# EAGLE design LimitSwitchandMotorBoard (EAGLE 9.6.2)
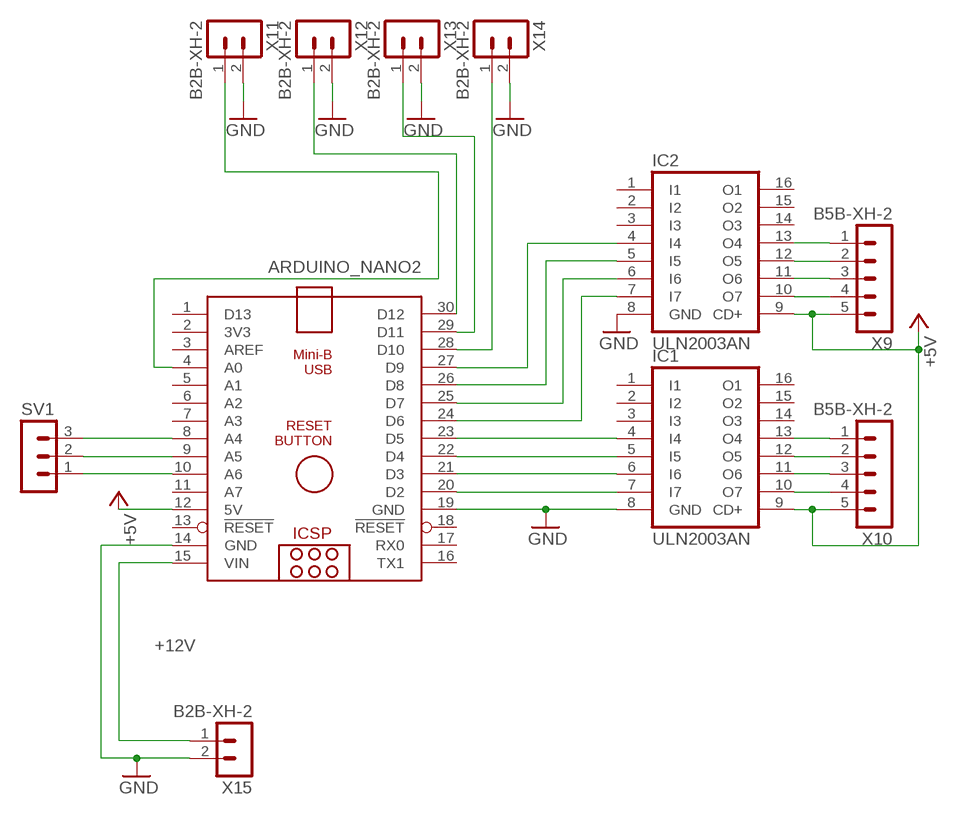
[diagram p0: schematic, sheet 1]

## Parts
ARDUINO_NANO2  ARDUINO_NANO  [ARDUINO_NANO]
IC1  ULN2003AN  [DIL16]
IC2  ULN2003AN  [DIL16]
SV1  MA03-1  [MA03-1]
X9  B5B-XH-2  [B5B-XH-A]
X10  B5B-XH-2  [B5B-XH-A]
X11  B2B-XH-2  [B2B-XH-A]
X12  B2B-XH-2  [B2B-XH-A]
X13  B2B-XH-2  [B2B-XH-A]
X14  B2B-XH-2  [B2B-XH-A]
X15  B2B-XH-2  [B2B-XH-A]

## Nets
+5V: ARDUINO_NANO2.12(5V) IC1.9(CD+) IC2.9(CD+) X9.5 X10.5
+12V: ARDUINO_NANO2.15(VIN) X15.1
GND: ARDUINO_NANO2.14(GND) ARDUINO_NANO2.19(GND) IC1.8(GND) IC2.8(GND) X11.2 X12.2 X13.2 X14.2 X15.2
N$1: ARDUINO_NANO2.29(D11) X13.1
N$2: IC1.10(O7) X10.4
N$3: IC1.11(O6) X10.3
N$4: IC1.12(O5) X10.2
N$5: IC1.13(O4) X10.1
N$6: IC2.10(O7) X9.4
N$7: IC2.11(O6) X9.3
N$8: IC2.12(O5) X9.2
N$9: IC2.13(O4) X9.1
N$10: ARDUINO_NANO2.20(D2) IC1.7(I7)
N$11: ARDUINO_NANO2.21(D3) IC1.6(I6)
N$12: ARDUINO_NANO2.22(D4) IC1.5(I5)
N$13: ARDUINO_NANO2.23(D5) IC1.4(I4)
N$14: ARDUINO_NANO2.27(D9) IC2.4(I4)
N$15: ARDUINO_NANO2.26(D8) IC2.5(I5)
N$16: ARDUINO_NANO2.25(D7) IC2.6(I6)
N$17: ARDUINO_NANO2.24(D6) IC2.7(I7)
N$18: ARDUINO_NANO2.30(D12) X12.1
N$19: ARDUINO_NANO2.4(A0) X11.1
N$20: ARDUINO_NANO2.8(A4) SV1.3
N$21: ARDUINO_NANO2.9(A5) SV1.2
N$22: ARDUINO_NANO2.10(A6) SV1.1
N$26: ARDUINO_NANO2.28(D10) X14.1
Unconnected: ARDUINO_NANO2.1(D13) ARDUINO_NANO2.2(3V3) ARDUINO_NANO2.3(AREF) ARDUINO_NANO2.5(A1) ARDUINO_NANO2.6(A2) ARDUINO_NANO2.7(A3) ARDUINO_NANO2.11(A7) ARDUINO_NANO2.13(!RESET) ARDUINO_NANO2.16(TX1) ARDUINO_NANO2.17(RX0) ARDUINO_NANO2.18(!RESET) IC1.1(I1) IC1.2(I2) IC1.3(I3) IC1.14(O3) IC1.15(O2) IC1.16(O1) IC2.1(I1) IC2.2(I2) IC2.3(I3) IC2.14(O3) IC2.15(O2) IC2.16(O1)

## Library data of the parts
ARDUINO_NANO2 = ArduinoNanoV31:ARDUINO_NANO: Arduino Nano V3.0 Overview: The Arduino Nano is a small, complete, and breadboard-friendly board based on the ATmega328 (Arduino Nano 3.x) or ATmega168 (Arduino Nano 2.x). It has more or less the same functionality of the Arduino Duemilanove, but in a different package. It lacks only a DC power jack, and works with a Mini-B USB cable instead of a standard one. The Nano was designed and is being produced by Gravitech. Specifications: Microcontroller Atmel ATmega168 or ATmega328 Operating Voltage (logic level) 5 V Input Voltage (recommended) 7-12 V Input Voltage (limits) 6-20 V Digital I/O Pins 14 (of which 6 provide PWM output) Analog Input Pins 8 DC Current per I/O Pin 40 mA Flash Memory 16 KB (ATmega168) or 32 KB (ATmega328) of which 2 KB used by bootloader SRAM 1 KB (ATmega168) or 2 KB (ATmega328) EEPROM 512 bytes (ATmega168) or 1 KB (ATmega328) Clock Speed 16 MHz Dimensions 0.73" x 1.70" Length 45 mm Width 18 mm Weigth 5 g Power: The Arduino Nano can be powered via the Mini-B USB connection, 6-20V unregulated external power supply (pin 30), or 5V regulated external power supply (pin 27). The power source is automatically selected to the highest voltage source. Memory: The ATmega168 has 16 KB of flash memory for storing code (of which 2 KB is used for the bootloader); the ATmega328 has 32 KB, (also with 2 KB used for the bootloader). The ATmega168 has 1 KB of SRAM and 512 bytes of EEPROM (which can be read and written with the EEPROM library); the ATmega328 has 2 KB of SRAM and 1 KB of EEPROM. Input and Output: Each of the 14 digital pins on the Nano can be used as an input or output, using pinMode(), digitalWrite(), and digitalRead() functions. They operate at 5 volts. Each pin can provide or receive a maximum of 40 mA and has an internal pull-up resistor (disconnected by default) of 20-50 kOhms. In addition, some pins have specialized functions. Visit Arduino - ArduinoBoardNano <https://www.arduino.cc/en/Main/ArduinoBoardNano>
IC1 IC2 = uln-udn:ULN2003A: DRIVER ARRAY
SV1 = con-lstb:MA03-1: PIN HEADER; OC_FARNELL: unknown; OC_NEWARK: unknown
X9 X10 = con-JST XH:B5B-XH: JST XH series header 2.50mm pitch disconnectable crimp style connectors, vertical (side entry type), 5 pins
X11-X15 = con-JST XH:B2B-XH: JST XH series header 2.50mm pitch disconnectable crimp style connectors, vertical (side entry type), 2 pins

## Board
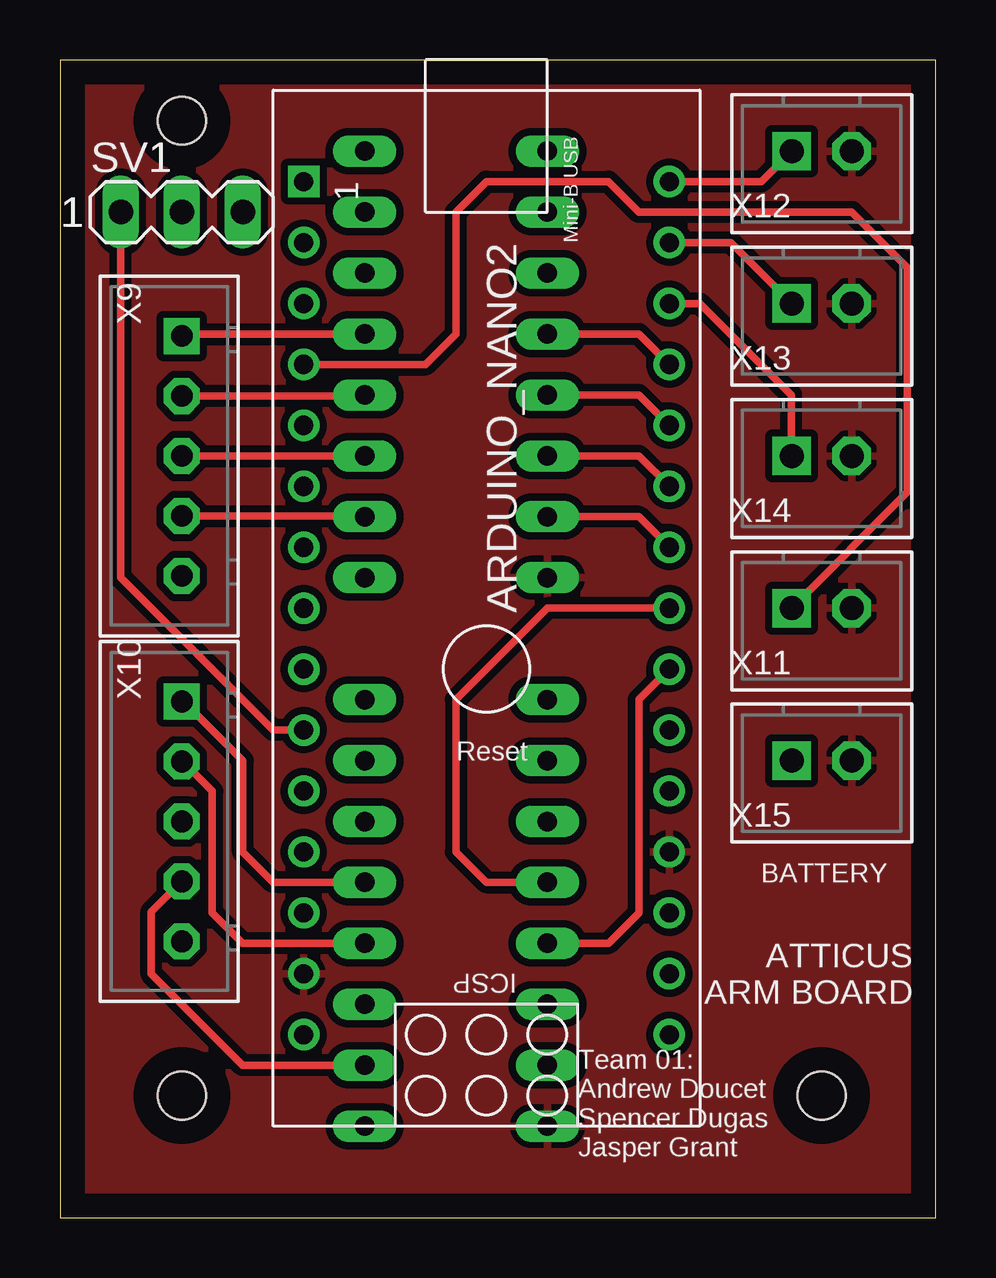
[diagram p1: board, top side]
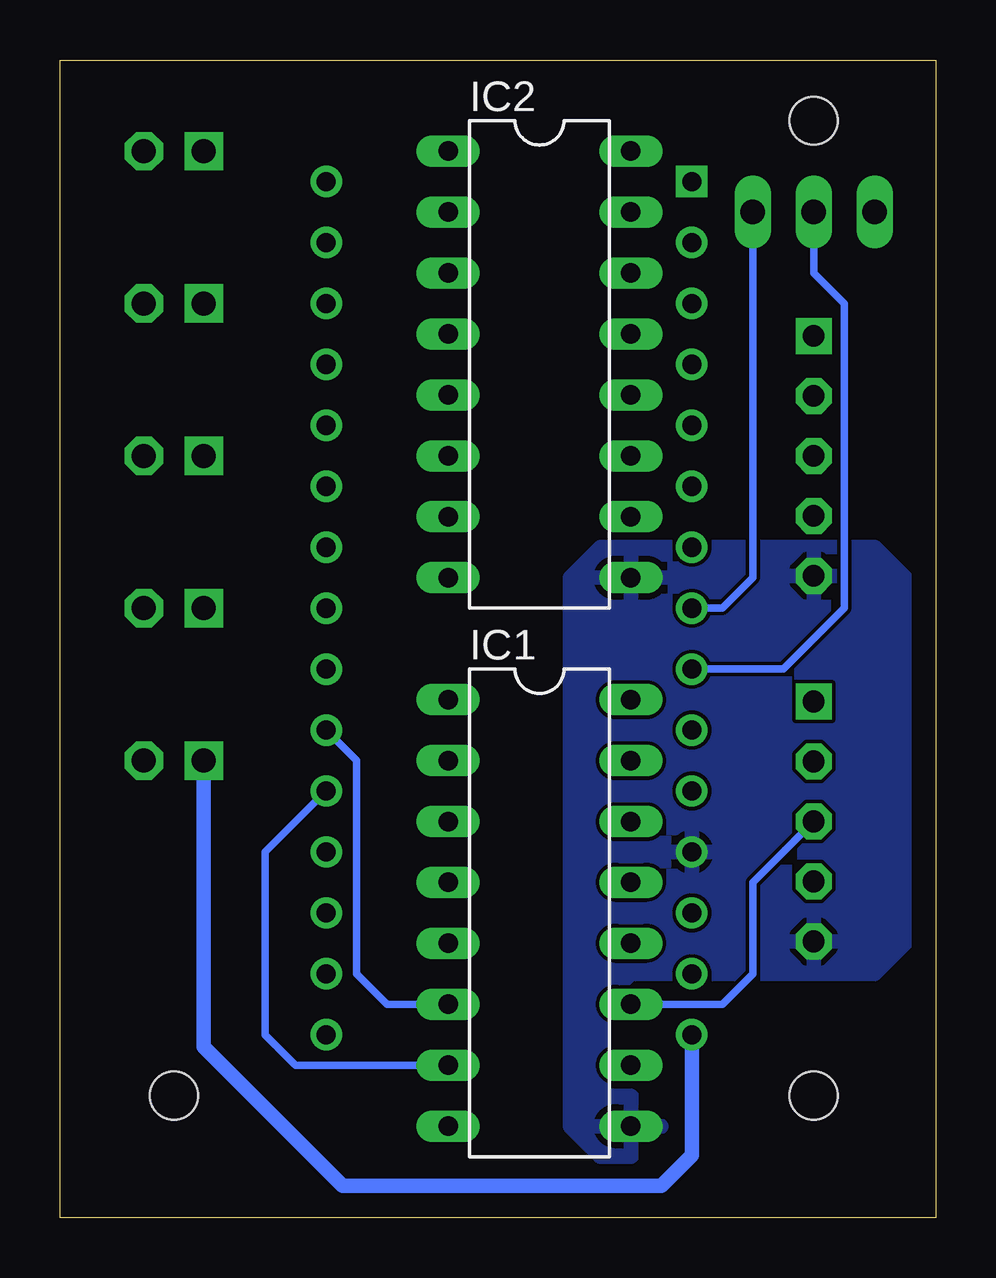
[diagram p2: board, bottom side, seen from below]

Size 36.5 x 48.25 mm. Coordinates in mm from the lower left corner, seen from the top.
Outline: 0,0 36.5,0 36.5,48.25 0,48.25 0,0
Copper layers (1*16): Top 0.035mm / dielectric 1.5mm / Bottom 0.035mm
Design rules "default": minimum track width 6mil, minimum drill 0.35mm, track to track 6mil, track to pad 6mil, pad to pad 6mil, via to via 6mil, smd to smd 6mil, copper to edge 40mil, drill to drill 6mil, minimum pad ring 10mil, minimum via ring 8mil, stop-mask expansion 4mil, vias tented up to drill 0mil, thermal gap 10mil
Holes 2 mm at 5.08,45.72 31.75,5.08 5.08,5.08

### Footprints (pad centres in the part's own frame; a part is rotated, then mirrored left to right if it is on the bottom)
ARDUINO_NANO = drill 0.8 square: 1 -20.32,-7.62 | drill 0.8: 2 -17.78,-7.62; 3 -15.24,-7.62; 4 -12.7,-7.62; 5 -10.16,-7.62; 6 -7.62,-7.62; 7 -5.08,-7.62; 8 -2.54,-7.62; 9 0,-7.62; 10 2.54,-7.62; 11 5.08,-7.62; 12 7.62,-7.62; 13 10.16,-7.62; 14 12.7,-7.62; 15 15.24,-7.62; 16 15.24,7.62; 17 12.7,7.62; 18 10.16,7.62; 19 7.62,7.62; 20 5.08,7.62; 21 2.54,7.62; 22 0,7.62; 23 -2.54,7.62; 24 -5.08,7.62; 25 -7.62,7.62; 26 -10.16,7.62; 27 -12.7,7.62; 28 -15.24,7.62; 29 -17.78,7.62; 30 -20.32,7.62
DIL16 = drill 0.813 long: 1 -8.89,-3.81; 2 -6.35,-3.81; 3 -3.81,-3.81; 4 -1.27,-3.81; 5 1.27,-3.81; 6 3.81,-3.81; 7 6.35,-3.81; 8 8.89,-3.81; 9 8.89,3.81; 10 6.35,3.81; 11 3.81,3.81; 12 1.27,3.81; 13 -1.27,3.81; 14 -3.81,3.81; 15 -6.35,3.81; 16 -8.89,3.81
MA03-1 = drill 1.016 long: 1 -2.54,0; 2 0,0; 3 2.54,0
B5B-XH-A = drill 0.9 pad 1.5 square: 1 5,0 | drill 0.9 pad 1.5 octagon: 2 2.5,0; 3 0,0; 4 -2.5,0; 5 -5,0
B2B-XH-A = drill 1 pad 1.6 square: 1 1.25,0 | drill 1 pad 1.6 octagon: 2 -1.25,0

### Placement (x,y rotation side)
ARDUINO_NANO2  17.78,22.86 270 top
IC1  16.51,12.7 270 bottom
IC2  16.51,35.56 270 bottom
SV1  5.08,41.91 0 top
X9  5.08,31.75 90 top
X10  5.08,16.51 90 top
X11  31.75,25.4 180 top
X12  31.75,44.45 180 top
X13  31.75,38.1 180 top
X14  31.75,31.75 180 top
X15  31.75,19.05 180 top

### Tracks (layer width: path | path; a pad name or v marks a point on that pad's centre or on a via)
+5V
  pour Bottom: 6.35,10.16 2.54,10.16 1.27,11.43 1.27,26.67 2.54,27.94 13.97,27.94 15.24,26.67 15.24,25.4 15.24,3.81 13.97,2.54 12.7,2.54 11.43,3.81 12.7,5.08 13.97,5.08 13.97,8.89 12.7,10.16
+12V
  Bottom 0.61: ARDUINO_NANO2.15 10.16,2.59 11.43,1.32 24.71,1.32 30.5,7.11 X15.1
GND
  pour Top (isolate 0.305): 0,48.26 0,0 36.83,0 36.83,48.26
N$1
  Top 0.305: X13.1 27.96,40.64 ARDUINO_NANO2.29
N$2
  Top 0.305: X10.4 3.81,12.74 3.81,10.16 7.62,6.35 IC1.10
N$3
  Bottom 0.305: X10.3 7.62,13.97 7.62,10.16 8.89,8.89 IC1.11
N$4
  Top 0.305: IC1.12 7.62,11.43 6.35,12.7 6.35,17.78 5.12,19.01 X10.2
N$5
  Top 0.305: IC1.13 8.89,13.97 7.62,15.24 7.62,19.05 5.16,21.51 X10.1
N$6
  Top 0.305: X9.4 12.66,29.25 IC2.10
N$7
  Top 0.305: X9.3 IC2.11
N$8
  Top 0.305: IC2.12 12.66,34.25 X9.2
N$9
  Top 0.305: X9.1 5.16,36.83 IC2.13
N$10
  Bottom 0.305: IC1.7 26.67,6.35 27.94,7.62 27.94,15.24 ARDUINO_NANO2.20
N$11
  Bottom 0.305: ARDUINO_NANO2.21 24.13,19.05 24.13,10.16 22.86,8.89 IC1.6
N$12
  Top 0.305: IC1.5 22.86,11.43 24.13,12.7 24.13,21.59 ARDUINO_NANO2.22
N$13
  Top 0.305: ARDUINO_NANO2.23 20.32,25.4 16.51,21.59 16.51,15.24 17.78,13.97 IC1.4
N$14
  Top 0.305: IC2.4 24.13,36.83 ARDUINO_NANO2.27
N$15
  Top 0.305: IC2.5 24.13,34.29 ARDUINO_NANO2.26
N$16
  Top 0.305: IC2.6 24.13,31.75 ARDUINO_NANO2.25
N$17
  Top 0.305: IC2.7 24.13,29.21 ARDUINO_NANO2.24
N$18
  Top 0.305: X12.1 29.23,43.18 ARDUINO_NANO2.30
N$19
  Top 0.305: ARDUINO_NANO2.4 15.24,35.56 16.51,36.83 16.51,41.91 17.78,43.18 22.86,43.18 24.13,41.91 33.02,41.91 35.33,39.6 35.33,30.23 X11.1
N$20
  Bottom 0.305: ARDUINO_NANO2.8 8.89,25.4 7.62,26.67 SV1.3
N$21
  Bottom 0.305: ARDUINO_NANO2.9 6.35,22.86 3.81,25.4 3.81,38.1 5.08,39.37 SV1.2
N$22
  Top 0.305: ARDUINO_NANO2.10 8.89,20.32 2.54,26.67 SV1.1
N$26
  Top 0.305: X14.1 30.48,31.77 30.48,34.29 26.67,38.1 ARDUINO_NANO2.28

### Text on the board
tNames: BATTERY | ATTICUS / ARM BOARD | Team 01: / Andrew Doucet / Spencer Dugas / Jasper Grant